# EAGLE design Tardis (EAGLE 9.4.0)
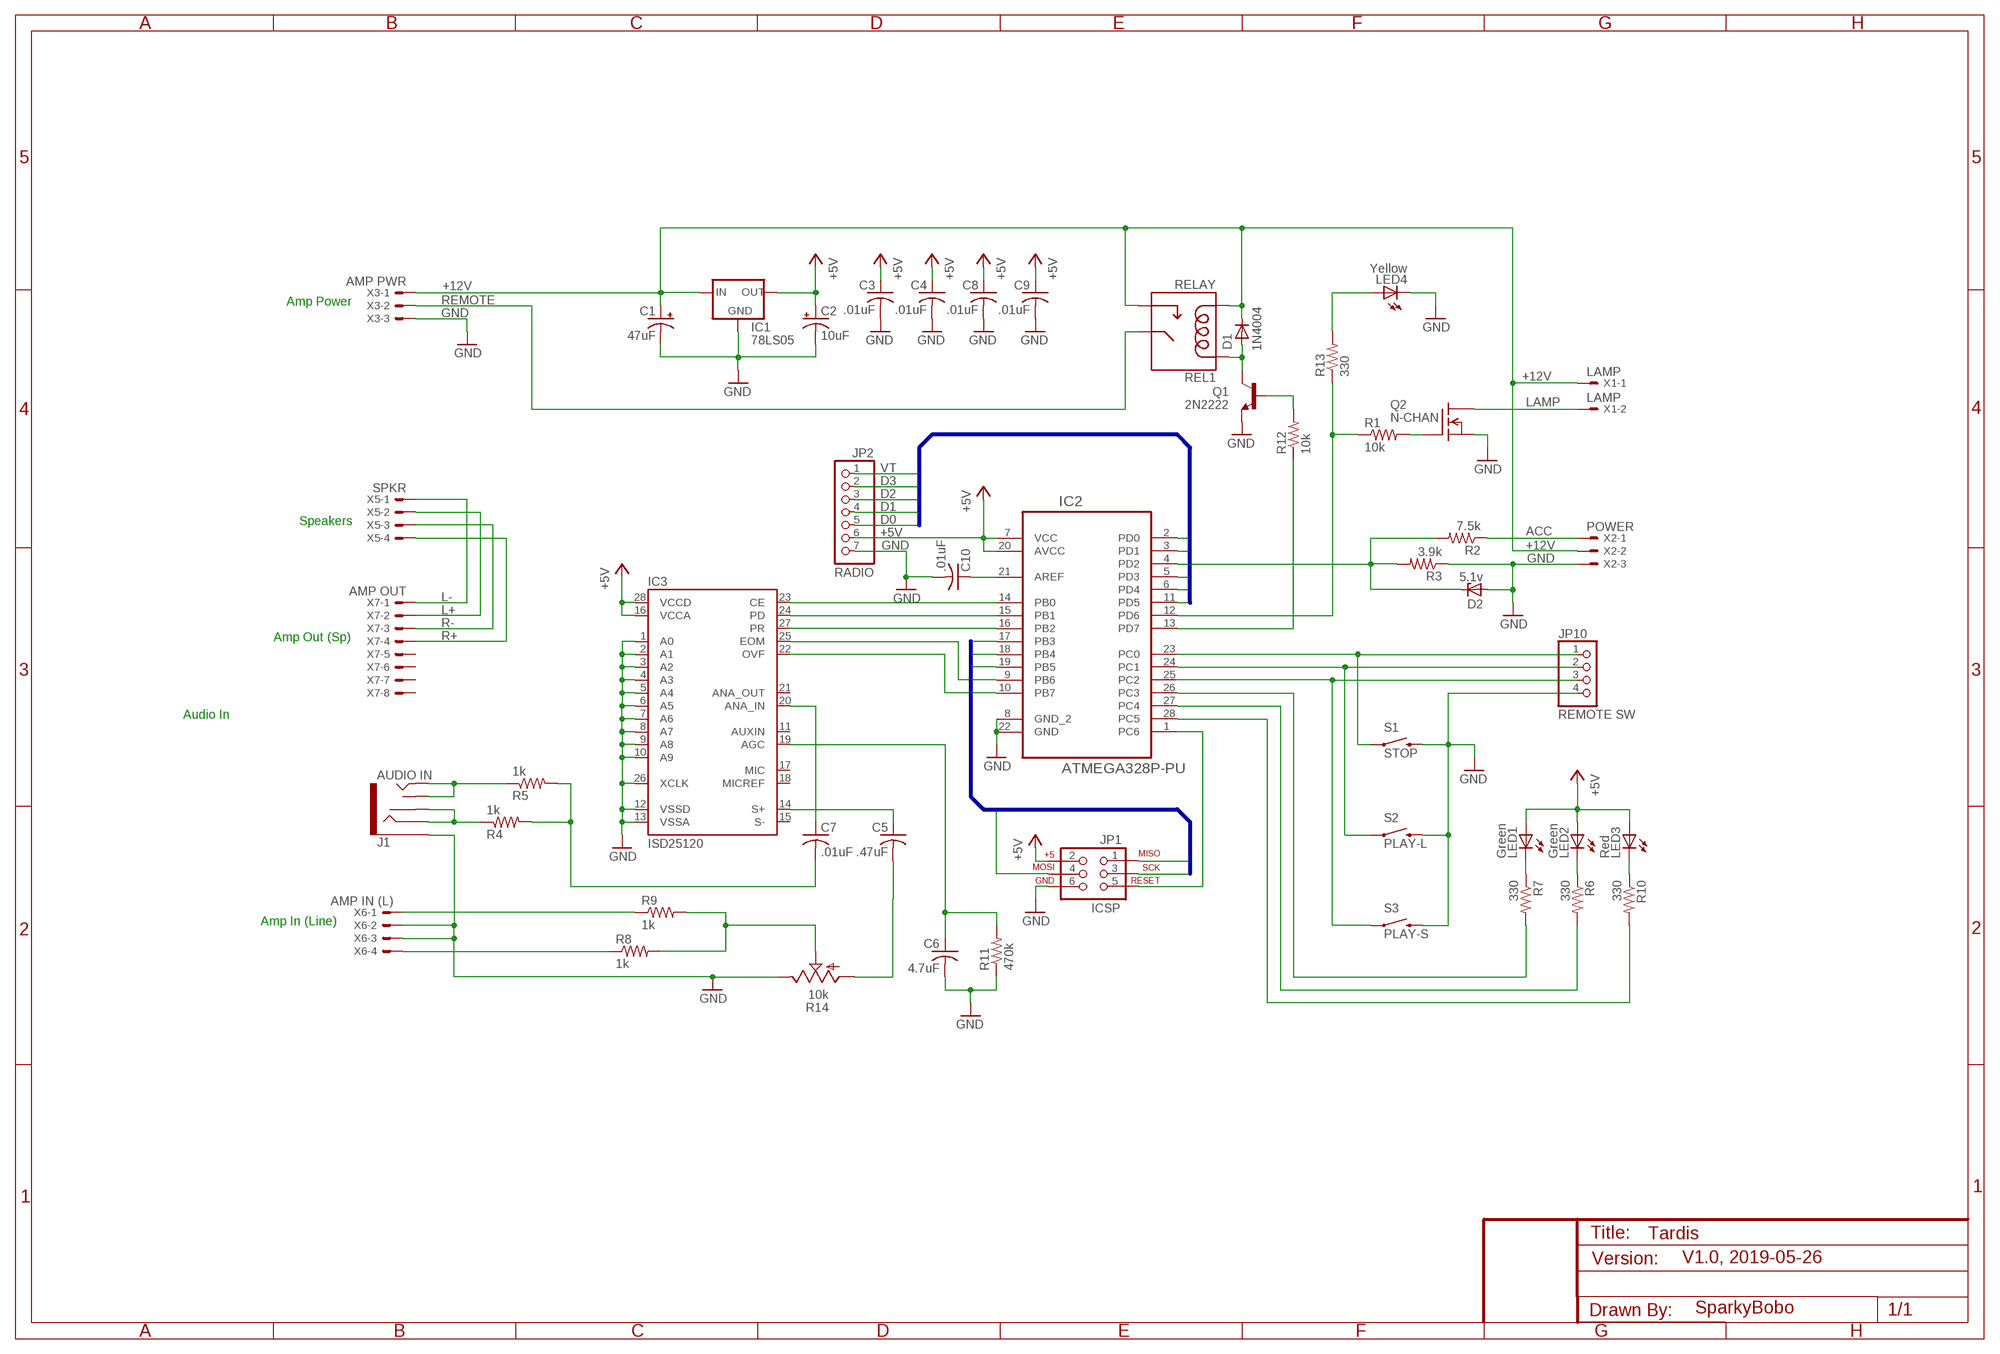
[diagram p0: schematic, sheet 1]

## Parts
C1  47uF  CPOL-USE3.5-8  [E3,5-8]
C2  10uF  CPOL-USE3.5-8  [E3,5-8]
C3  .01uF  C-US025-025X050  [C025-025X050]
C4  .01uF  C-US025-025X050  [C025-025X050]
C5  .47uF  C-US025-025X050  [C025-025X050]
C6  4.7uF  C-US025-025X050  [C025-025X050]
C7  .01uF  C-US050-025X075  [C050-025X075]
C8  .01uF  C-US025-025X050  [C025-025X050]
C9  .01uF  C-US025-025X050  [C025-025X050]
C10  .01uF  C-US025-025X050  [C025-025X050]
D1  1N4004  DIODE1N4148  [DIODE-1N4148]
D2  5.1v  ZENER-DIODEDO35Z10  [DO35Z10]
IC1  78LS05  V_REG_78XXTO-92  [TO-92]
IC2  ATMEGA328P-PU  [DIP254P762X457-28]
IC3  ISD25120  CRAZYGIRAFFE_ISD25120  [CRAZYGIRAFFE_DIL28-6]
J1  AUDIO IN  AUDIO-JACK2PTH  [AUDIO-JACK]
JP1  ICSP  AVR_SPI_PRG_6PTH  [2X3]
JP2  RADIO  PINHD-1X7  [1X07]
JP10  REMOTE SW  PINHD-1X4  [1X04]
LED1  Green  LED5MM  [LED5MM]
LED2  Green  LED5MM  [LED5MM]
LED3  Red  LED5MM  [LED5MM]
LED4  Yellow  LED5MM  [LED5MM]
Q1  2N2222  TRANSISTOR_NPNTO92  [TO-92]
Q2  N-CHAN  BUZ10  [TO220]
R1  10k  R-US_0207/10  [0207/10]
R2  7.5k  R-US_0207/10  [0207/10]
R3  3.9k  R-US_0207/10  [0207/10]
R4  1k  R-US_0207/10  [0207/10]
R5  1k  R-US_0207/10  [0207/10]
R6  330  R-US_0207/10  [0207/10]
R7  330  R-US_0207/10  [0207/10]
R8  1k  R-US_0207/10  [0207/10]
R9  1k  R-US_0207/10  [0207/10]
R10  330  R-US_0207/10  [0207/10]
R11  470k  R-US_0207/10  [0207/10]
R12  10k  R-US_0207/10  [0207/10]
R13  330  R-US_0207/10  [0207/10]
R14  10k  TRIM_US-CA6V  [CA6V]
REL1  RELAY  CRAZYGIRAFFE_RELAY  [CRAZYGIRAFFE_RELAY-DIP]
S1  STOP  CRAZYGIRAFFE_SWITCH-MOMENTARY-212MM  [CRAZYGIRAFFE_TACTILE-PTH-12MM]
S2  PLAY-L  CRAZYGIRAFFE_SWITCH-MOMENTARY-212MM  [CRAZYGIRAFFE_TACTILE-PTH-12MM]
S3  PLAY-S  CRAZYGIRAFFE_SWITCH-MOMENTARY-212MM  [CRAZYGIRAFFE_TACTILE-PTH-12MM]
X1  LAMP  KK-156-2  [KK-156-2]
X2  POWER  KK-156-3  [KK-156-3]
X3  AMP PWR  KK-156-3  [KK-156-3]
X5  SPKR  KK-156-4  [KK-156-4]
X6  AMP IN (L)  KK-156-4  [KK-156-4]
X7  AMP OUT  KK-156-8  [KK-156-8]

## Nets
+5V: C2.+ C3.1 C4.1 C8.1 C9.1 IC1.3(OUT) IC2.7(VCC) IC2.20(AVCC) IC3.16(VCCA) IC3.28(VCCD) JP1.2 JP2.6 LED1.A LED2.A LED3.A
+12V: C1.+ D1.C IC1.2(IN) REL1.2(COIL2) REL1.4(NO) X1.1 X2.2 X3.1
ACC: R2.1 X2.1
AUD-OUT: R8.2 R9.2 R14.S
D0: IC2.3(PD1) JP2.5
D1: IC2.2(PD0) JP2.4
D2: IC2.11(PD5) JP2.3
D3: IC2.6(PD4) JP2.2
GND: C1.- C2.- C3.2 C4.2 C6.2 C8.2 C9.2 C10.2 D2.A IC1.1(GND) IC2.8(GND_2) IC2.22(GND) IC3.1(A0) IC3.2(A1) IC3.3(A2) IC3.4(A3) IC3.5(A4) IC3.6(A5) IC3.7(A6) IC3.8(A7) IC3.9(A8) IC3.10(A9) IC3.12(VSSD) IC3.13(VSSA) IC3.26(XCLK) J1.SLEEVE JP1.6 JP2.7 JP10.4 LED4.K(C) Q1.1(E) Q2.3(S) R3.1 R11.1 R14.E S1.3 S2.3 S3.3 X2.3 X3.3 X6.2 X6.3
L+: X5.2 X7.2
L-: X5.1 X7.1
LAMP: Q2.2(D) X1.2
MISO: IC2.18(PB4) JP1.1
MOSI: IC2.17(PB3) JP1.4
N$1: Q2.1(G) R1.2
N$2: Q1.2(B) R12.2
N$3: IC2.13(PD7) R12.1
N$4: D2.C IC2.4(PD2) R2.2 R3.2
N$5: IC2.16(PB2) IC3.27(PR)
N$6: IC2.1(PC6) JP1.5
N$7: C5.1 IC3.14(S+)
N$8: IC2.23(PC0) JP10.1 S1.1
N$9: C6.1 IC3.19(AGC) R11.2
N$10: C7.1 IC3.20(ANA_IN)
N$11: IC2.12(PD6) R1.1 R13.1
N$12: IC2.15(PB1) IC3.24(PD)
N$13: IC2.14(PB0) IC3.23(CE)
N$14: IC2.24(PC1) JP10.2 S2.1
N$15: J1.RING J1.RSH R4.1
N$16: IC2.25(PC2) JP10.3 S3.1
N$17: IC2.26(PC3) R7.2
N$18: LED1.K(C) R7.1
N$19: LED2.K(C) R6.1
N$20: J1.TIP J1.TSH R5.1
N$21: R9.1 X6.1
N$22: R8.1 X6.4
N$23: IC2.9(PB6) IC3.25(EOM)
N$24: IC2.10(PB7) IC3.22(OVF)
N$25: LED3.K(C) R10.1
N$26: IC2.27(PC4) R6.2
N$27: LED4.A R13.2
N$29: C10.1 IC2.21(AREF)
N$30: D1.A Q1.3(C) REL1.1(COIL1)
N$31: C7.2 R4.2 R5.2
N$32: C5.2 R14.A
R+: X5.4 X7.4
R-: X5.3 X7.3
REMOTE: REL1.3(MAIN) X3.2
SCK: IC2.19(PB5) JP1.3
ST1: IC2.28(PC5) R10.2
VT: IC2.5(PD3) JP2.1
Unconnected: IC3.11(AUXIN) IC3.15(S-) IC3.17(MIC) IC3.18(MICREF) IC3.21(ANA_OUT) X7.5 X7.6 X7.7 X7.8

## Buses
SCK,MOSI,MISO
VT,D3,D2,D1,D0

## Notes on the sheet
- Amp Power
- Speakers
- Amp Out (Sp)
- Audio In
- Amp In (Line)
- V1.0, 2019-05-26
- SparkyBobo

## Library data of the parts
C1 C2 = rcl:CPOL-US: POLARIZED CAPACITOR, American symbol
C3-C10 = rcl:C-US: CAPACITOR, American symbol
D1 = SparkFun-DiscreteSemi:DIODE: Diode These are standard reverse protection diodes and small signal diodes. SMA package can handle up to about 1A. SOD-323 can handle about 200mA. What the SOD-323 package when ordering, there are some mfgs out there that are 5-pin packages.
D2 = diode:ZENER-DIODE: Z-Diode
IC1 = SparkFun-PowerIC:V_REG_78XX: Voltage Regulator Standard 7805 5V regulator. IGO (Input Ground Output). Spark Fun Electronics SKU : COM-00107
IC2 = CrazyGiraffe-Tardis:ATMEGA328P-PU: 8-bit Microcontroller with In-System Programmable Flash; MPN: ATMEGA328P-PU; OC_FARNELL: 1715487; OC_NEWARK: 15R0268; PACKAGE: PDIP-28; SUPPLIER: Atmel
IC3 = CrazyGiraffe-Tardis:CRAZYGIRAFFE_ISD25120: IC MEM VOICE REC/PLAY 120S 28DIP
J1 = SparkFun-Connectors:AUDIO-JACK2: Stereo audio jack with bypass switches.
JP1 = SparkFun-Connectors:AVR_SPI_PRG_6: AVR ISP 6 Pin This is the reduced ISP connector for AVR programming. Common on Arduino. This footprint will take up less PCB space and can be used with a 10-pin to 6-pin adapter such as SKU: BOB-08508
JP2 = pinhead:PINHD-1X7: PIN HEADER
JP10 = pinhead:PINHD-1X4: PIN HEADER
LED1-LED4 = led:LED: LED OSRAM: - CHIPLED LG R971, LG N971, LY N971, LG Q971, LY Q971, LO R971, LY R971 LH N974, LH R974 LS Q976, LO Q976, LY Q976 LO Q996 - Hyper CHIPLED LW Q18S LB Q993, LB Q99A, LB R99A - SideLED LS A670, LO A670, LY A670, LG A670, LP A670 LB A673, LV A673, LT A673, LW A673 LH A674 LY A675 LS A676, LA A676, LO A676, LY A676, LW A676 LS A679, LY A679, LG A679 - Hyper Micro SIDELED® LS Y876, LA Y876, LO Y876, LY Y876 LT Y87S - SmartLED LW L88C, LW L88S LB L89C, LB L89S, LG L890 LS L89K, LO L89K, LY L89K LS L896, LA L896, LO L896, LY L896 - TOPLED LS T670, LO T670, LY T670, LG T670, LP T670 LSG T670, LSP T670, LSY T670, LOP T670, LYG T670 LG T671, LOG T671, LSG T671 LB T673, LV T673, LT T673, LW T673 LH T674 LS T676, LA T676, LO T676, LY T676, LB T676, LH T676, LSB T676, LW T676 LB T67C, LV T67C, LT T67C, LS T67K, LO T67K, LY T67K, LW E67C LS E67B, LA E67B, LO E67B, LY E67B, LB E67C, LV E67C, LT E67C LW T67C LS T679, LY T679, LG T679 LS T770, LO T770, LY T770, LG T770, LP T770 LB T773, LV T773, LT T773, LW T773 LH T774 LS E675, LA E675, LY E675, LS T675 LS T776, LA T776, LO T776, LY T776, LB T776 LHGB T686 LT T68C, LB T68C - Hyper Mini TOPLED® LB M676 - Mini TOPLED Santana® LG M470 LS M47K, LO M47K, LY M47K Source: http://www.osram.convergy.de LUXEON: - LUMILED® LXK2-PW12-R00, LXK2-PW12-S00, LXK2-PW14-U00, LXK2-PW14-V00 LXK2-PM12-R00, LXK2-PM12-S00, LXK2-PM14-U00 LXK2-PE12-Q00, LXK2-PE12-R00, LXK2-PE12-S00, LXK2-PE14-T00, LXK2-PE14-U00 LXK2-PB12-K00, LXK2-PB12-L00, LXK2-PB12-M00, LXK2-PB14-N00, LXK2-PB14-P00, LXK2-PB14-Q00 LXK2-PR12-L00, LXK2-PR12-M00, LXK2-PR14-Q00, LXK2-PR14-R00 LXK2-PD12-Q00, LXK2-PD12-R00, LXK2-PD12-S00 LXK2-PH12-R00, LXK2-PH12-S00 LXK2-PL12-P00, LXK2-PL12-Q00, LXK2-PL12-R00 Source: www.luxeon.com KINGBRIGHT: KA-3528ASYC Source: www.kingbright.com
Q1 = SparkFun-DiscreteSemi:TRANSISTOR_NPN: Generic NPN BJT. MMBT2222 is the common NPN we use. Double check against datasheet- not all devices are the same!
Q2 = transistor-fet:BUZ10: N-Channel Enhancement MOSFET 50V; 20A; 0,080Ohm
R1-R13 = rcl:R-US_: RESISTOR, American symbol
R14 = pot:TRIM_US-: POTENTIOMETER
REL1 = CrazyGiraffe-Tardis:CRAZYGIRAFFE_RELAY
S1-S3 = CrazyGiraffe-Tardis:CRAZYGIRAFFE_SWITCH-MOMENTARY-2
X1 = con-molex:KK-156-2: KK 156 HEADER Source: http://www.molex.com/pdm_docs/sd/026604100_sd.pdf; OC_FARNELL: unknown; OC_NEWARK: unknown
X2 X3 = con-molex:KK-156-3: KK 156 HEADER Source: http://www.molex.com/pdm_docs/sd/026604100_sd.pdf; OC_FARNELL: unknown; OC_NEWARK: unknown
X5 X6 = con-molex:KK-156-4: KK 156 HEADER Source: http://www.molex.com/pdm_docs/sd/026604100_sd.pdf; OC_FARNELL: unknown; OC_NEWARK: unknown
X7 = con-molex:KK-156-8: KK 156 HEADER Source: http://www.molex.com/pdm_docs/sd/026604100_sd.pdf; OC_FARNELL: unknown; OC_NEWARK: unknown

## Net classes
1 vcc: width 0.025 mm
2 gnd: width 0.025 mm

## Board
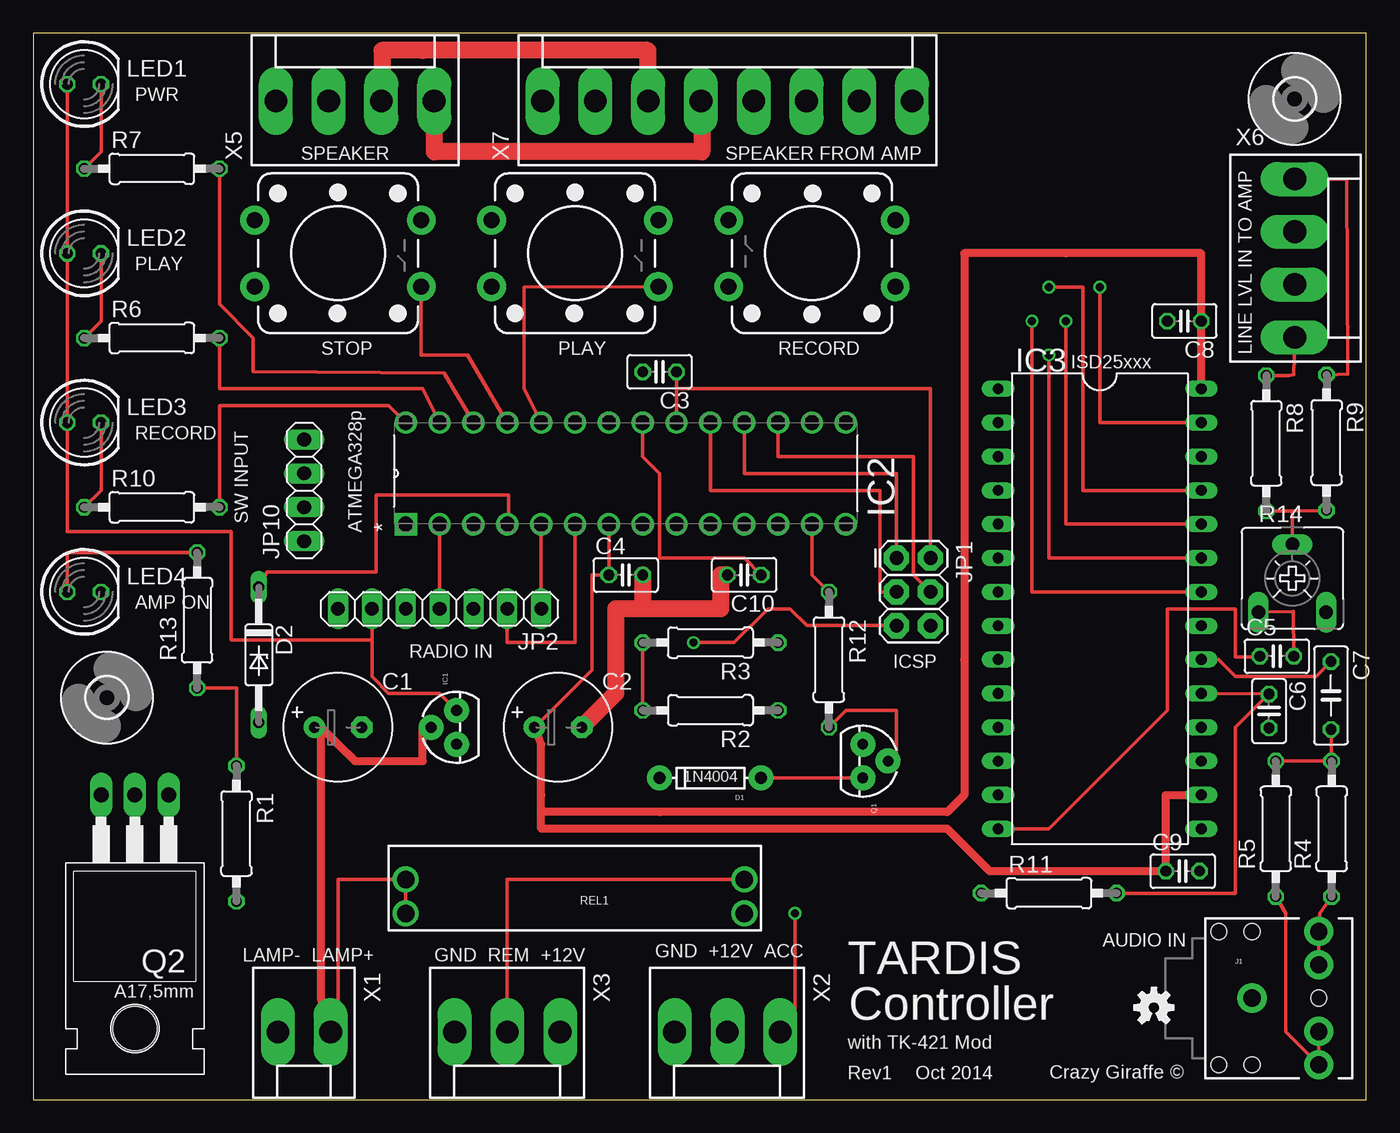
[diagram p1: board, top side]
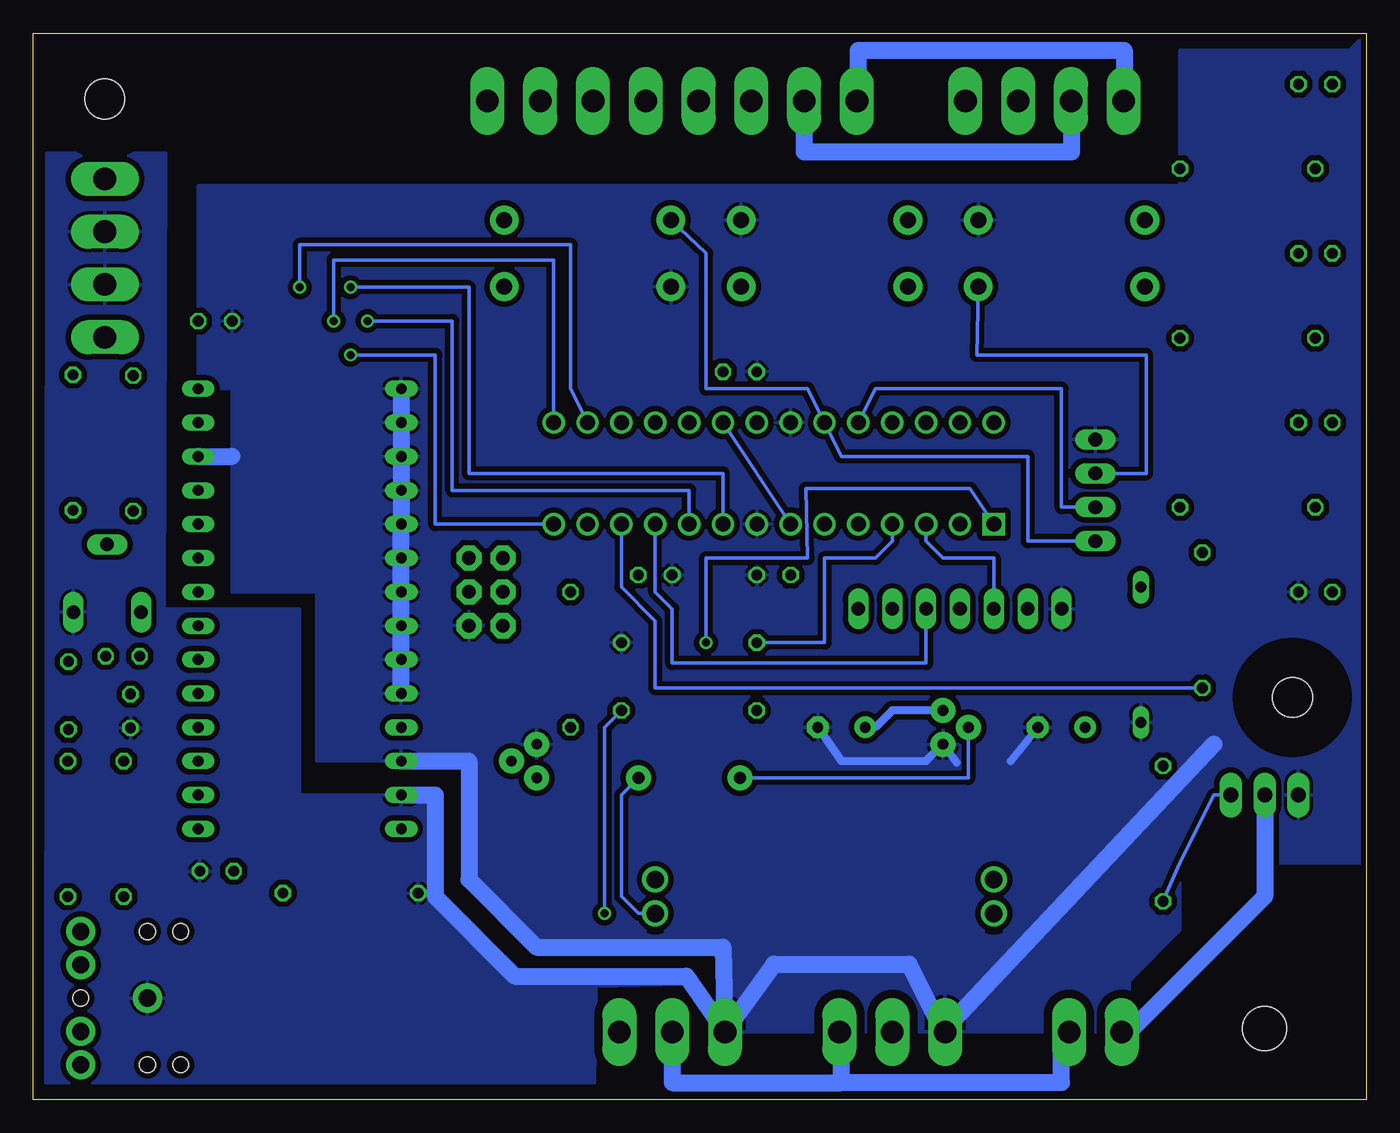
[diagram p2: board, bottom side, seen from below]

Size 100 x 80 mm. Coordinates in mm from the lower left corner, seen from the top.
Outline: 0,0 100,0 100,80 0,80 0,0
Copper layers (1*16): Top 0.0356mm / dielectric 1.5011mm / Bottom 0.0356mm
Design rules "LaenPCBOrder": minimum track width 6mil, minimum drill 13mil, track to track 6mil, track to pad 6mil, pad to pad 6mil, via to via 6mil, smd to smd 6mil, copper to edge 15mil, drill to drill 6mil, minimum pad ring 7mil, minimum via ring 7mil, stop-mask expansion 3mil, vias tented up to drill 0mil, thermal gap 10mil

### Footprints (pad centres in the part's own frame; a part is rotated, then mirrored left to right if it is on the bottom)
E3,5-8 = drill 0.813 pad 1.6: + -1.778,0 | drill 0.813 pad 1.6 octagon: - 1.778,0
C025-025X050 = drill 0.813 octagon: 1 -1.27,0; 2 1.27,0
C050-025X075 = drill 0.813 octagon: 1 -2.54,0; 2 2.54,0
DIODE-1N4148 = drill 0.9 pad 1.88: A -3.81,0; C 3.81,0
DO35Z10 = drill 0.813 long: A 5.08,0; C -5.08,0
TO-92 = drill 0.813 pad 1.88: 1 -1.27,0; 2 0,1.905; 3 1.27,0
DIP254P762X457-28 = drill 1.118 square: 1 -7.62,33.02 | drill 1.118: 2 -7.62,30.48; 3 -7.62,27.94; 4 -7.62,25.4; 5 -7.62,22.86; 6 -7.62,20.32; 7 -7.62,17.78; 8 -7.62,15.24; 9 -7.62,12.7; 10 -7.62,10.16; 11 -7.62,7.62; 12 -7.62,5.08; 13 -7.62,2.54; 14 -7.62,0; 15 0,0; 16 0,2.54; 17 0,5.08; 18 0,7.62; 19 0,10.16; 20 0,12.7; 21 0,15.24; 22 0,17.78; 23 0,20.32; 24 0,22.86; 25 0,25.4; 26 0,27.94; 27 0,30.48; 28 0,33.02
CRAZYGIRAFFE_DIL28-6 = drill 0.813 long: 1 -16.51,-7.62; 2 -13.97,-7.62; 3 -11.43,-7.62; 4 -8.89,-7.62; 5 -6.35,-7.62; 6 -3.81,-7.62; 7 -1.27,-7.62; 8 1.27,-7.62; 9 3.81,-7.62; 10 6.35,-7.62; 11 8.89,-7.62; 12 11.43,-7.62; 13 13.97,-7.62; 14 16.51,-7.62; 15 16.51,7.62; 16 13.97,7.62; 17 11.43,7.62; 18 8.89,7.62; 19 6.35,7.62; 20 3.81,7.62; 21 1.27,7.62; 22 -1.27,7.62; 23 -3.81,7.62; 24 -6.35,7.62; 25 -8.89,7.62; 26 -11.43,7.62; 27 -13.97,7.62; 28 -16.51,7.62
AUDIO-JACK = drill 1.3 pad 2.184: RING 5,5; RSH 5,2.5; SLEEVE 0,0; TIP 5,-5; TSH 5,-2.5 | hole 1.2: 0,5; -2.5,5; -2.5,-5; 0,-5; 5,0
2X3 = drill 1.016 pad 1.88 octagon: 1 0,0; 2 0,2.54; 3 2.54,0; 4 2.54,2.54; 5 5.08,0; 6 5.08,2.54
1X07 = drill 1.016 long: 1 -7.62,0; 2 -5.08,0; 3 -2.54,0; 4 0,0; 5 2.54,0; 6 5.08,0; 7 7.62,0
1X04 = drill 1.016 long: 1 -3.81,0; 2 -1.27,0; 3 1.27,0; 4 3.81,0
LED5MM = drill 0.813 octagon: A -1.27,0; K 1.27,0
TO220 = drill 1.118 long: 1 -2.54,-6.35; 2 0,-6.35; 3 2.54,-6.35 | hole 3.302: 0,11.176
0207/10 = drill 0.813 octagon: 1 -5.08,0; 2 5.08,0
CA6V = drill 1.016 long: A -2.54,-2.54; E 2.54,-2.54; S 0,2.54
CRAZYGIRAFFE_RELAY-DIP = drill 1.3: 1 -11.43,2.54; 2 13.97,2.54; 3 -11.43,0; 4 13.97,0
CRAZYGIRAFFE_TACTILE-PTH-12MM = drill 1.2 pad 2.159: 1 6.25,-2.5; 2 -6.25,-2.5; 3 6.25,2.5; 4 -6.25,2.5
3,0 = hole 3: 0,0
KK-156-2 = drill 1.7 pad 2.184 long: 1 -1.98,0; 2 1.98,0
KK-156-3 = drill 1.7 pad 2.184 long: 1 -3.96,0; 2 0,0; 3 3.96,0
KK-156-4 = drill 1.7 pad 2.184 long: 1 -5.94,0; 2 -1.98,0; 3 1.98,0; 4 5.94,0
KK-156-8 = drill 1.7 pad 2.184 long: 1 -13.86,0; 2 -9.9,0; 3 -5.94,0; 4 -1.98,0; 5 1.98,0; 6 5.94,0; 7 9.9,0; 8 13.86,0

### Placement (x,y rotation side)
C1  22.86,27.94 0 top
C2  39.37,27.94 0 top
C3  46.99,54.61 180 top
C4  44.45,39.37 0 top
C5  93.29,33.27 0 top
C6  92.71,29.16 270 top
C7  97.36,30.33 270 top
C8  86.36,58.42 180 top
C9  86.23,17.14 0 top
C10  53.34,39.37 180 top
D1  50.8,24.13 180 top
D2  16.92,33.38 270 top
IC1  31.75,27.94 90 top
IC2  60.96,50.8 90 top
IC3  80.01,36.83 270 top
J1  91.44,7.62 0 top
JP1  64.77,40.64 270 top
JP2  30.48,36.83 180 top
JP10  20.32,45.72 90 top
LED1  3.81,76.2 0 top
LED2  3.81,63.5 0 top
LED3  3.81,50.8 0 top
LED4  3.81,38.1 0 top
Q1  62.23,25.4 270 top
Q2  7.62,16.51 180 top
R1  15.24,19.96 270 top
R2  50.8,29.21 180 top
R3  50.8,34.29 180 top
R4  97.41,20.32 90 top
R5  93.22,20.32 90 top
R6  8.89,57.15 0 top
R7  8.89,69.85 0 top
R8  92.51,49.25 270 top
R9  97.03,49.3 270 top
R10  8.89,44.45 0 top
R11  76.2,15.49 0 top
R12  59.69,33.02 270 top
R13  12.29,35.97 90 top
R14  94.46,39.12 0 top
REL1  41.91,16.51 180 top
S1  58.42,63.5 180 top
S2  40.64,63.5 0 top
S3  22.86,63.5 0 top
U$1  [3,0]  5.54,30.18 0 top
U$2  [3,0]  94.64,75.08 0 top
U$3  [OSHW-LOGO-S]  84.07,6.91 0 top
X1  20.32,5.08 180 top
X2  52.07,5.08 180 top
X3  35.56,5.08 180 top
X5  24.13,74.93 0 top
X6  94.64,63.14 270 top
X7  52.07,74.93 0 top

### Tracks (layer width: path | path; a pad name or v marks a point on that pad's centre or on a via)
+5V
  Top 0.254: LED1.A LED2.A LED3.A 2.54,42.62 14.83,42.62 14.83,34.49 25.4,34.49 | C8.1 87.63,55.88 IC3.28 | IC2.7 C4.1 41.91,39.37 41.91,32.26 C2.+ | JP2.6 25.4,34.49 | 25.4,34.49 25.4,31.75 26.67,30.48 30.48,30.48 IC1.3 | C3.1 48.26,53.34 | 48.26,53.34 IC2.20 | JP1.2 67.31,53.34 48.26,53.34
  Top 0.61: IC3.28 87.63,55.88 87.63,63.5 77.47,63.5 69.85,63.5 69.85,33.02 69.85,22.86 68.58,21.59 46.99,21.59 38.1,21.59 | 38.1,21.59 38.1,20.32 68.58,20.32 71.75,17.14 C9.1 84.96,22.86 IC3.16 | 38.1,21.59 38.1,22.86 38.1,26.67 C2.+
  Bottom 0.254: IC2.7 IC2.20
  Bottom 0.61: IC1.3 35.56,29.21 36.83,27.94 C2.+
+12V
  Top 0.254: X1.1 22.86,6.35 22.86,16.51 REL1.4 REL1.2
  Top 0.61: IC1.2 29.21,27.94 29.21,25.4 27.94,25.4 24.13,25.4 22.86,26.67 21.59,27.94 | C1.+ 21.59,27.94 | X1.1 21.59,7.62 21.59,27.94
  Bottom 0.254: 39.37,1.27 39.37,5.08 | 39.37,5.08 X3.1 39.37,5.08 | IC1.2 29.84,24.13 D1.C
  Bottom 1.27: 39.37,1.27 52.07,1.27 X2.2 | 39.37,1.27 39.37,5.08 | 39.37,1.27 22.86,1.27 22.86,3.81 X1.1
ACC  (via drill 0.6)
  Top 0.254: v57.15,13.97 57.15,6.35 X2.1
  Bottom 0.254: R2.1 57.15,27.94 v57.15,13.97
AUD-OUT
  Top 0.254: R14.S 94.46,44.17 | 94.46,44.17 R9.2 | 94.46,44.17 R8.2
D0
  Bottom 0.254: IC2.3 33.02,41.91 31.75,40.64 27.94,40.64 JP2.5
D1
  Top 0.254: JP2.4 IC2.2
D2
  Bottom 0.254: JP2.3 33.02,32.77 52.07,32.77 52.07,36.83 53.34,38.1 IC2.11
D3
  Top 0.254: JP2.2 35.56,34.29 40.64,34.29 IC2.6
GND
  Top 1.27: C10.2 51.56,39.37 51.56,36.83 45.72,36.83 | 45.72,36.83 43.69,36.83 43.69,30.48 C2.- | C4.2 45.72,36.83
  Bottom 0.61: C1.- 26.67,25.4 | 30.73,25.3 IC1.1 33.02,25.4 39.37,25.4 C2.-
  Bottom 1.27: IC3.9 IC3.10 IC3.8 IC3.7 IC3.6 IC3.5 IC3.4 IC3.3 IC3.2 IC3.1 | X2.3 50.99,9.27 63.88,9.27 69.85,15.24 69.85,22.86 IC3.13 | 31.75,5.08 34.29,10.16 44.45,10.16 X2.3 | 31.75,5.08 X3.3 | 11.43,26.67 31.75,5.08 | IC3.12 67.31,25.4 67.31,16.51 62.23,11.43 48.26,11.43 X2.3 | IC3.26 85.09,48.26
  pour Bottom (isolate 0.406): 72.39,25.4 78.74,25.4 78.74,38.1 85.09,38.1 85.09,60.96 81.28,60.96 81.28,53.34 72.39,53.34
  pour Bottom (isolate 0.406): 90.07,71.07 90.17,36.83 80.01,36.83 80.01,22.86 69.85,22.86 69.85,1.27 99.06,1.27 99.01,71.02
  pour Bottom (isolate 0.61): 50.8,8.89 48.26,6.35 48.26,5.08
  pour Bottom (isolate 0.61): 72.39,25.4 67.31,25.4 67.31,16.51 62.23,11.43 48.26,11.43 48.26,5.08 17.78,5.08 17.78,8.89 13.97,12.7 60.96,12.7 66.04,17.78 66.04,26.67 72.39,26.67
  pour Bottom (isolate 0.406): 72.39,25.4 72.39,52.07 73.66,53.34 87.63,53.34 87.63,68.58 13.97,68.58 13.97,78.74 1.27,78.74 0,80.01 0,17.78 13.97,17.78 13.97,12.7 60.96,12.7 66.04,17.78 66.04,25.4
  pour Bottom (isolate 0.61): 48.26,5.08 50.67,9.65 63.63,9.78 69.98,16 70.23,1.27 57.91,1.27 57.78,8.51 51.18,8.64 48.39,4.95
L+
  Bottom 1.27: X5.2 22.1,74.55 22.1,71.12 42.16,71.12 42.16,74.55 X7.2
L-
  Bottom 1.27: X5.1 18.16,75.56 18.16,78.74 38.1,78.74 38.1,74.93 X7.1
LAMP
  Bottom 1.27: Q2.2 7.62,15.24 17.78,5.08 X1.2
MISO
  Top 0.254: IC2.18 53.34,46.99 64.77,46.99 JP1.1
MOSI
  Top 0.254: IC2.17 55.88,48.26 66.04,48.26 66.04,39.37 JP1.4
N$1
  Bottom 0.254: Q2.1 11.43,22.86 13.97,17.78 R1.2
N$2
  Top 0.254: R12.2 60.96,29.21 64.77,29.21 64.77,25.4 Q1.2
N$3
  Top 0.254: IC2.13 58.42,39.37 R12.1
N$4
  Top 0.254: R2.2 R3.2 | D2.C 17.53,39.57 25.7,39.57 25.7,45.36 35.66,45.36 35.66,43.18 IC2.4
  Bottom 0.254: IC2.4 35.56,41.91 36.83,40.64 40.64,40.64 40.64,34.29 R3.2
N$5  (via drill 0.6)
  Top 0.254: v80.01,60.96 80.01,50.8 IC3.27
  Bottom 0.254: IC2.16 59.69,53.34 59.69,64.14 80.01,64.14 v80.01,60.96
N$6  (via drill 0.6)
  Top 0.254: JP1.5 58.04,35.56 56.77,36.83 55.12,36.83 52.58,34.29 v49.53,34.29
  Bottom 0.254: v49.53,34.29 49.53,40.64 41.91,40.64 42.04,45.85 29.72,45.85 IC2.1
N$7
  Top 0.254: IC3.14 76.2,20.32 85.09,29.21 85.09,36.83 90.17,36.83 90.17,33.22 91.44,33.22 C5.1
N$8
  Bottom 0.254: JP10.1 25.4,41.91 25.4,48.26 39.37,48.26 IC2.23 41.91,53.34 49.53,53.34 49.53,63.5 S1.1
N$9
  Top 0.254: IC3.19 C6.1 90.17,27.94 90.17,16.51 90.17,15.49 84.96,15.49 R11.2
N$10
  Top 0.254: IC3.20 88.9,33.02 90.17,31.75 96.24,31.75 C7.1
N$11
  Top 0.254: R1.1 15.24,30.89 R13.1
  Bottom 0.254: IC2.12 55.88,38.46 53.34,35.92 53.34,30.89 R13.1
N$12  (via drill 0.6)
  Top 0.254: v77.47,58.42 77.47,43.18 IC3.24
  Bottom 0.254: IC2.15 60.96,53.34 60.96,62.99 77.47,62.99 v77.47,58.42
N$13  (via drill 0.6)
  Top 0.254: v76.2,55.88 76.2,40.64 IC3.23
  Bottom 0.254: IC2.14 69.85,43.18 69.85,55.88 v76.2,55.88
N$14
  Top 0.254: S2.1 36.83,60.96 36.83,53.34 IC2.24
  Bottom 0.254: JP10.2 22.86,44.45 22.86,53.34 36.83,53.34 IC2.24
N$15
  Top 0.254: R4.1 96.52,13.97 96.52,12.7 J1.RING J1.RSH
N$16
  Top 0.254: S3.1 29.08,55.88 32.56,55.88 IC2.25
  Bottom 0.254: JP10.3 16.51,46.99 16.51,55.88 29.21,55.88 S3.1
N$17
  Top 0.254: IC2.26 30.84,54.51 16.51,54.61 16.51,57.15 13.97,59.69 R7.2
N$18
  Top 0.254: R7.1 5.08,71.12 LED1.K
N$19
  Top 0.254: R6.1 5.08,58.42 LED2.K
N$20
  Top 0.254: R5.1 93.98,13.97 93.98,5.08 J1.TIP | J1.TIP 96.52,2.54 J1.TIP | J1.TSH J1.TIP
N$21
  Top 0.254: R9.1 98.6,54.43 98.55,69.04 95.71,69.09 X6.1
N$22
  Top 0.254: R8.1 94.21,54.33 94.56,54.41 X6.4
N$23  (via drill 0.6)
  Top 0.254: v76.2,60.96 78.74,60.96 78.74,45.72 IC3.25
  Bottom 0.254: IC2.9 48.26,46.99 67.31,46.99 67.31,60.96 v76.2,60.96
N$24  (via drill 0.6)
  Top 0.254: IC3.22 74.93,38.1 v74.93,58.42
  Bottom 0.254: IC2.10 50.8,45.72 68.58,45.72 68.58,58.42 v74.93,58.42
N$25
  Top 0.254: R10.1 5.08,45.72 LED3.K
N$26
  Top 0.254: R6.2 13.97,53.34 29.21,53.34 IC2.27
N$27
  Top 0.254: LED4.A 2.54,41.05 R13.2
N$29
  Top 0.254: IC2.21 45.72,48.26 46.99,46.99 46.99,40.64 53.34,40.64 C10.1
N$30
  Top 0.254: Q1.3 D1.A
  Bottom 0.254: D1.A 55.88,22.86 55.88,15.24 54.61,13.97 REL1.1
N$31
  Top 0.254: C7.2 R4.2 R5.2
N$32
  Top 0.254: R14.A 94.51,36.63 C5.2
R+
  Top 1.27: X5.4 30.1,74.55 30.1,71.12 50.16,71.12 50.16,74.42 X7.4
R-
  Top 1.27: X5.3 26.16,75.44 26.16,76.83 26.16,78.74 29.21,78.74 46.1,78.74 46.1,75.06 X7.3
REMOTE
  Top 0.254: REL1.3 35.56,16.51 X3.2
SCK
  Top 0.254: IC2.19 50.8,45.72 63.5,45.72 63.5,38.1 JP1.3
ST1
  Top 0.254: R10.2 13.97,52.07 26.67,52.07 IC2.28
VT
  Top 0.254: JP2.1 IC2.5

### Text on the board
tPlace: PWR | SPEAKER | SPEAKER FROM AMP | LINE LVL IN TO AMP | PLAY | STOP | PLAY | RECORD | ISD25xxx | RECORD | SW INPUT | ATMEGA328p | AMP ON | RADIO IN | ICSP | GND +12V ACC | AUDIO IN | LAMP- LAMP+ | GND REM +12V | TARDIS | Controller | with TK-421 Mod | Rev1 | Oct 2014 | Crazy Giraffe ©